# Altium schematic sheet Sheet1.SchDoc
size A4
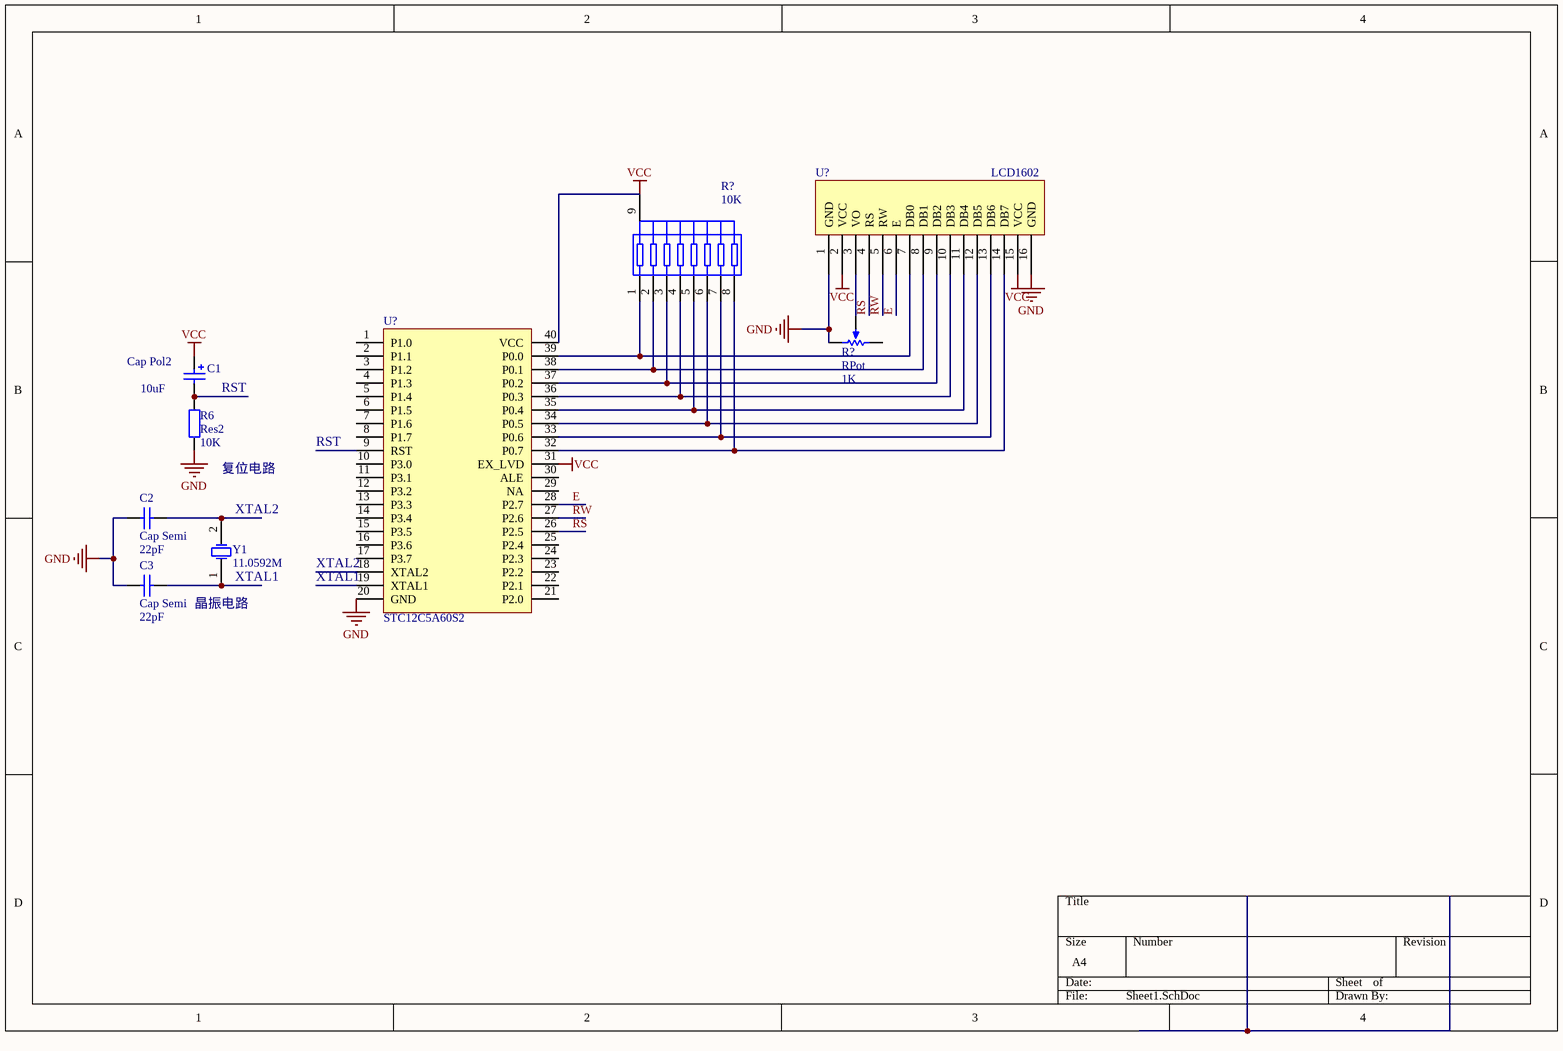
[diagram p0: Sheet1.SchDoc]

## Parts
(Parts that share a designator on the sheet are numbered #1, #2 ... from top to bottom, then left to right.)
C1  Cap Pol2  value 10uF  [POLAR0.8]
C2  Cap Semi  value 22pF  [CAPC3216L]
C3  Cap Semi  value 22pF  [CAPC3216L]
R6  Res2  value 10K  [AXIAL-0.4]
R?#1  10K
R?#2  RPot  value 1K  [VR5]
U?#1  LCD1602
U?#2  STC12C5A60S2  [Model Name]
Y1  11.0592M  [BCY-W2/D3.1]

## Nets
GND: C2.1 C3.1 R6.1 R?#2.2(BOT) U?#1.1(GND) U?#1.16(GND) U?#2.20(GND)
VCC: C1.1 U?#1.2(VCC) U?#1.15(VCC) U?#2.31(EX_LVD) U?#2.40(VCC)
E: U?#1.6(E) U?#2.28(P2.7)
RS: U?#1.4(RS) U?#2.26(P2.5)
RST: C1.2 R6.2 U?#2.9(RST)
RW: U?#1.5(RW) U?#2.27(P2.6)
XTAL1: C3.2 U?#2.19(XTAL1) Y1.1(OSC1)
XTAL2: C2.2 U?#2.18(XTAL2) Y1.2(OSC2)
NetR?#1_1: R?#1.1 U?#1.7(DB0) U?#2.39(P0.0)
NetR?#1_2: R?#1.2 U?#1.8(DB1) U?#2.38(P0.1)
NetR?#1_3: R?#1.3 U?#1.9(DB2) U?#2.37(P0.2)
NetR?#1_4: R?#1.4 U?#1.10(DB3) U?#2.36(P0.3)
NetR?#1_5: R?#1.5 U?#1.11(DB4) U?#2.35(P0.4)
NetR?#1_6: R?#1.6 U?#1.12(DB5) U?#2.34(P0.5)
NetR?#1_7: R?#1.7 U?#1.13(DB6) U?#2.33(P0.6)
NetR?#1_8: R?#1.8 U?#1.14(DB7) U?#2.32(P0.7)
NetR?#2_3: R?#2.3(TAP) U?#1.3(VO)

Not connected (* = marked no-connect by the designer): R?#1 9; R?#2 1(TOP); U?#2 1(P1.0) 2(P1.1) 3(P1.2) 4(P1.3) 5(P1.4) 6(P1.5) 7(P1.6) 8(P1.7) 10(P3.0) 11(P3.1) 12(P3.2) 13(P3.3) 14(P3.4) 15(P3.5) 16(P3.6) 17(P3.7) 21(P2.0) 22(P2.1) 23(P2.2) 24(P2.3) 25(P2.4) 29(NA) 30(ALE)

## Notes on the sheet
- Labels drawn without touching a wire or pin: 复位电路, 晶振电路

## Library data of the parts
C1 = Cap Pol2: Polarized Capacitor (Axial); Published: 8-Jun-2000; LatestRevisionDate: 17-Jul-2002; LatestRevisionNote: Re-released for DXP Platform.; PackageReference: POLAR0.8; Publisher: Altium Limited
C2 C3 = Cap Semi: Capacitor (Semiconductor SIM Model); Published: 8-Jun-2000; LatestRevisionDate: 29-May-2009; LatestRevisionNote: IPC-7351 Footprint Added.; PackageReference: C1206; Publisher: Altium Limited; PackageDescription: Chip Capacitor
R6 = Res2: Resistor; Published: 8-Jun-2000; LatestRevisionDate: 17-Jul-2002; LatestRevisionNote: Re-released for DXP Platform.; PackageReference: AXIAL-0.4; Publisher: Altium Limited
R?#1 = Component_1
R?#2 = RPot: Potentiometer; Sim Note: Enter the Resistance value and the set point into parameter fields.; Set Position: 0.5; Published: 8-Jun-2000; LatestRevisionDate: 17-Jul-2002; LatestRevisionNote: Re-released for DXP Platform.; PackageReference: VR5; Publisher: Altium Limited
Y1 = XTAL: Crystal Oscillator; Published: 8-Jun-2000; LatestRevisionDate: 17-Jul-2002; LatestRevisionNote: Re-released for DXP Platform.; PackageReference: R38; Publisher: Altium Limited